# EAGLE design QuadF32 (EAGLE 9.6.0)
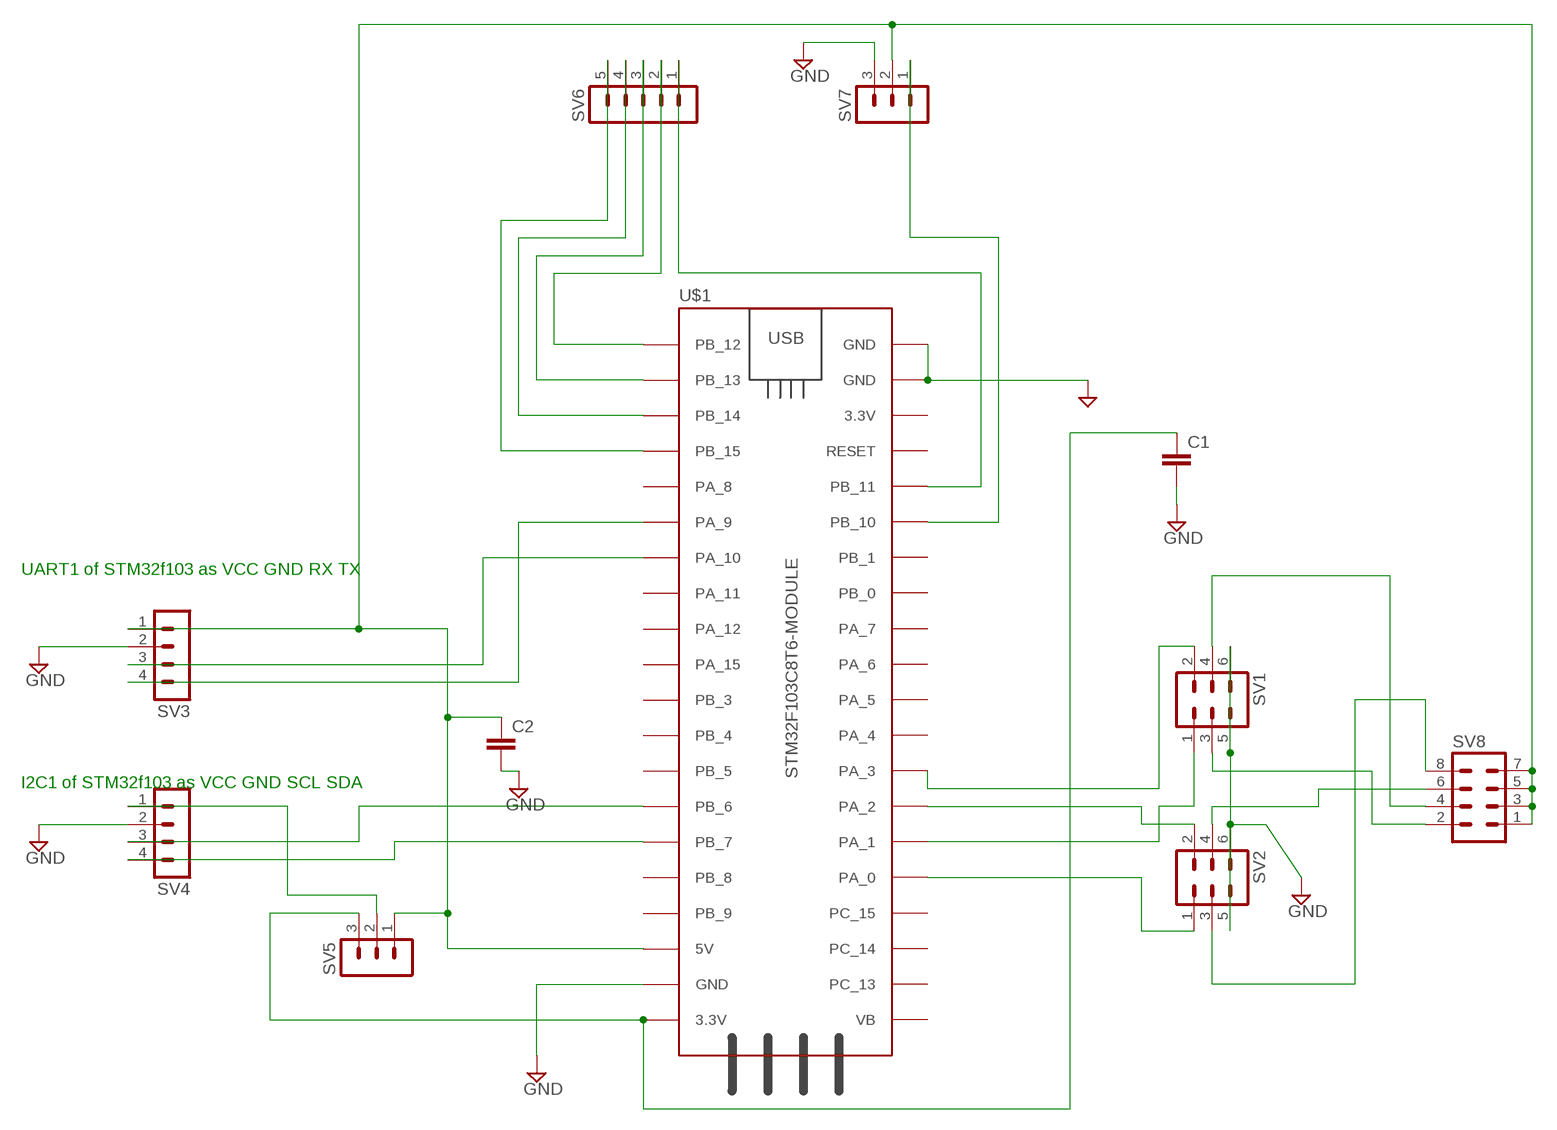
[diagram p0: schematic, sheet 1]

## Parts
C1  C5/2.5  [C5B2.5]
C2  C5/2.5  [C5B2.5]
SV1  MA03-2  [MA03-2]
SV2  MA03-2  [MA03-2]
SV3  MA04-1  [MA04-1]
SV4  MA04-1  [MA04-1]
SV5  MA03-1  [MA03-1]
SV6  MA05-1  [MA05-1]
SV7  MA03-1  [MA03-1]
SV8  MA04-2  [MA04-2]
U$1  STM32F103C8T6-MODULE  [STM32F103C8T6-MODULE]

## Nets
GND: C1.2 C2.2 SV1.5 SV1.6 SV2.5 SV2.6 SV3.2 SV4.2 SV7.3 U$1.GND_1(GND) U$1.GND_2(GND) U$1.GND_3(GND)
N$1: SV4.3 U$1.PB_6
N$2: SV4.4 U$1.PB_7
N$3: SV3.3 U$1.PA_10
N$4: SV3.4 U$1.PA_9
N$5: SV2.1 U$1.PA_0
N$6: SV2.2 U$1.PA_2
N$7: SV1.1 U$1.PA_1
N$8: SV1.2 U$1.PA_3
N$9: SV6.5 U$1.PB_15
N$10: SV6.4 U$1.PB_14
N$11: SV6.3 U$1.PB_13
N$12: SV6.2 U$1.PB_12
N$13: SV6.1 U$1.PB_11
N$14: SV7.1 U$1.PB_10
N$15: SV1.4 SV8.4
N$19: C1.1 SV5.3 U$1.3.3V_1(3.3V)
N$20: SV4.1 SV5.2
N$23: C2.1 SV3.1 SV5.1 SV7.2 SV8.1 SV8.3 SV8.5 SV8.7 U$1.5V
N$24: SV2.3 SV8.8
N$25: SV2.4 SV8.6
N$26: SV1.3 SV8.2
Unconnected: U$1.3.3V_2(3.3V) U$1.PA_4 U$1.PA_5 U$1.PA_6 U$1.PA_7 U$1.PA_8 U$1.PA_11 U$1.PA_12 U$1.PA_15 U$1.PB_0 U$1.PB_1 U$1.PB_3 U$1.PB_4 U$1.PB_5 U$1.PB_8 U$1.PB_9 U$1.PC_13 U$1.PC_14 U$1.PC_15 U$1.RESET U$1.VB

## Notes on the sheet
- UART1 of STM32f103 as VCC GND RX TX
- I2C1 of STM32f103 as VCC GND SCL SDA

## Library data of the parts
C1 C2 = capacitor-wima:C: CAPACITOR naming: grid - package width
SV1 SV2 = con-lstb:MA03-2: PIN HEADER; OC_FARNELL: unknown; OC_NEWARK: unknown
SV3 SV4 = con-lstb:MA04-1: PIN HEADER; OC_FARNELL: unknown; OC_NEWARK: unknown
SV5 SV7 = con-lstb:MA03-1: PIN HEADER; OC_FARNELL: unknown; OC_NEWARK: unknown
SV6 = con-lstb:MA05-1: PIN HEADER; OC_FARNELL: unknown; OC_NEWARK: unknown
SV8 = con-lstb:MA04-2: PIN HEADER; OC_FARNELL: unknown; OC_NEWARK: unknown
U$1 = stm32f103c8t6_module:STM32F103C8T6-MODULE: STM32F103C8T6 module with ARM Cortex-3, 20kB SRAM, 64kB Flash, 72MHz

## Board
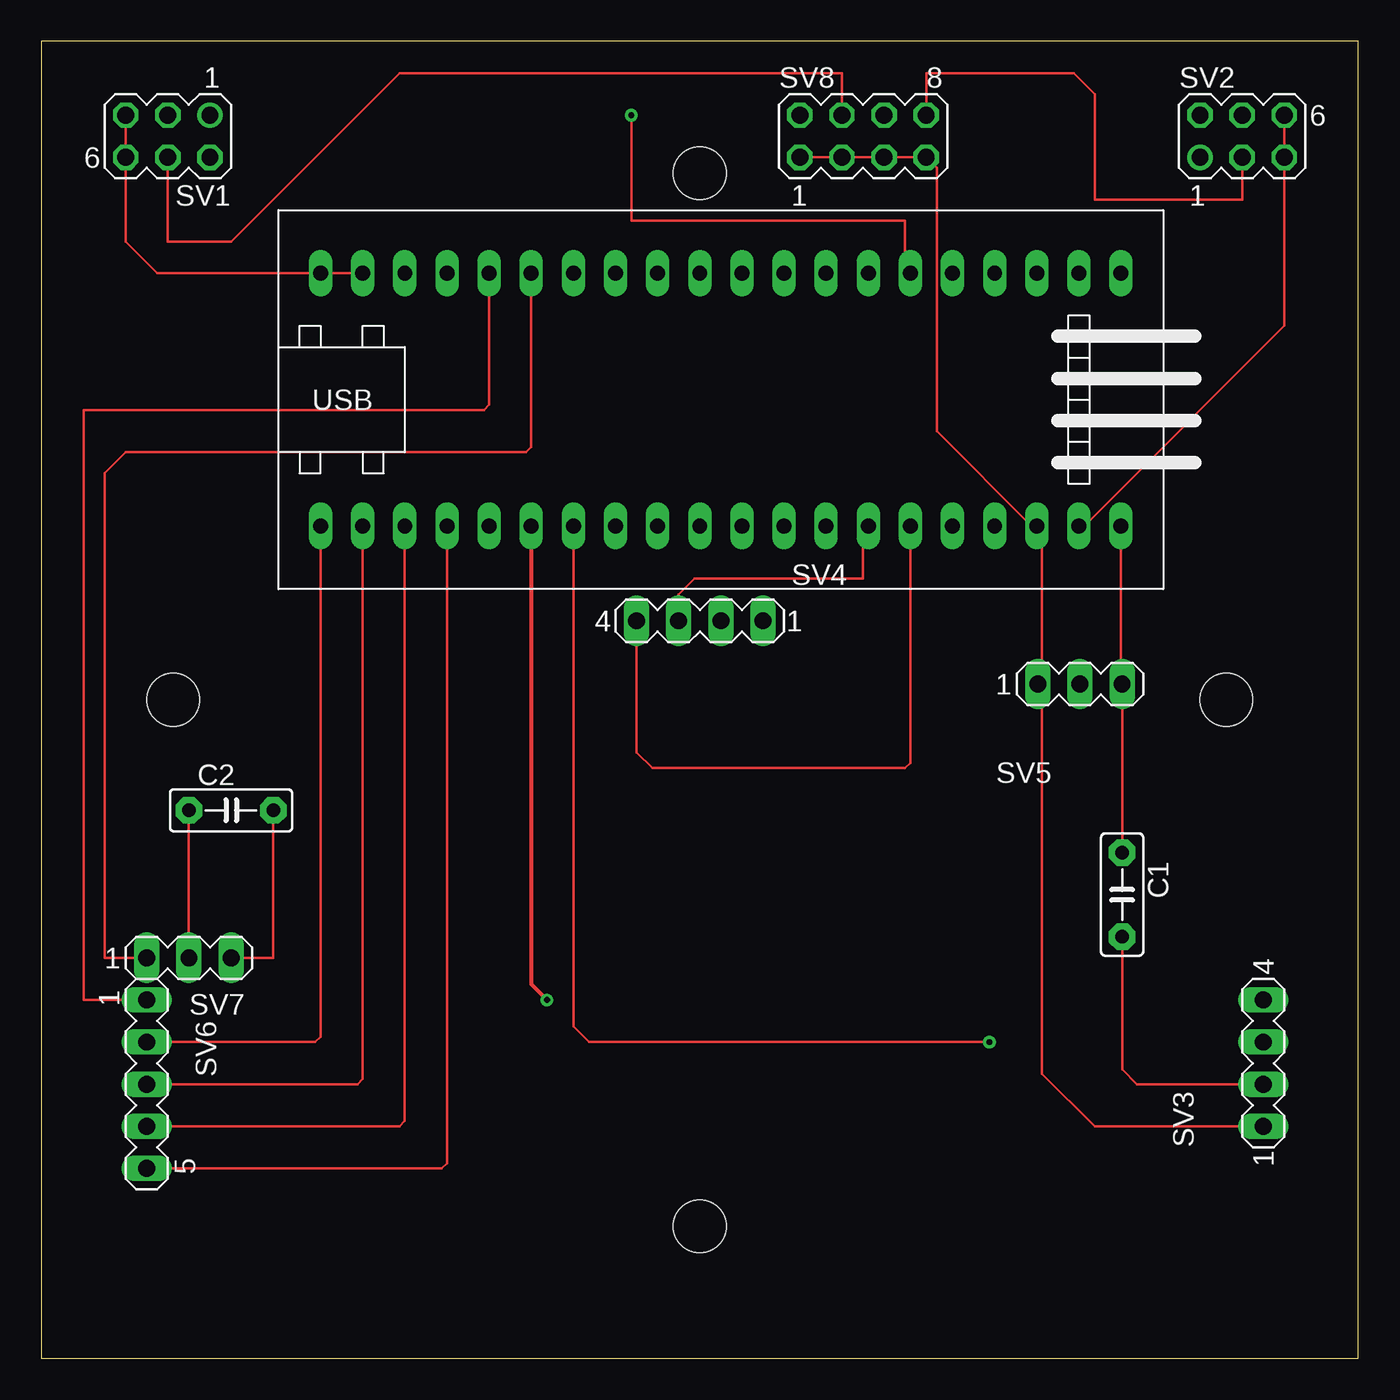
[diagram p1: board, top side]
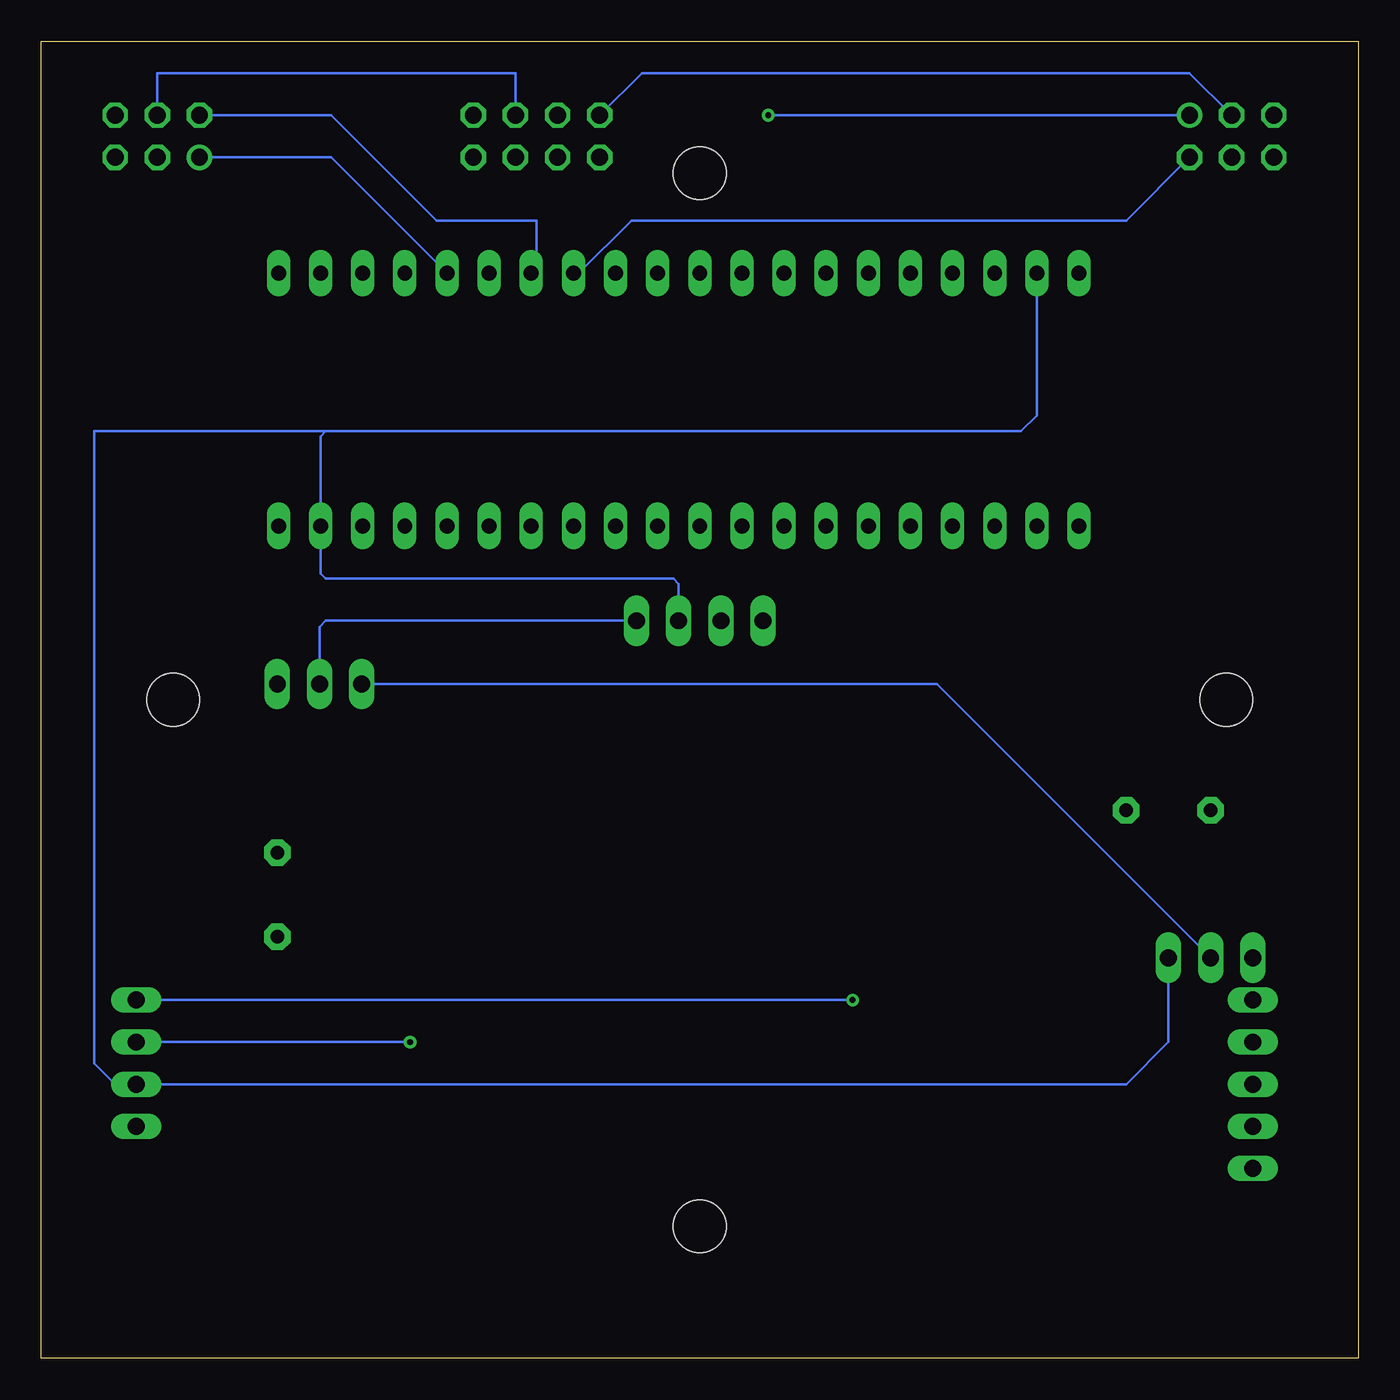
[diagram p2: board, bottom side, seen from below]

Size 79.38 x 79.38 mm. Coordinates in mm from the lower left corner, seen from the top.
Outline: 0,0 79.38,0 79.38,79.38 0,79.38 0,0
Copper layers (1*16): Top 0.035mm / dielectric 1.5mm / Bottom 0.035mm
Design rules "default": minimum track width 6mil, minimum drill 0.35mm, track to track 6mil, track to pad 6mil, pad to pad 6mil, via to via 6mil, smd to smd 6mil, copper to edge 40mil, drill to drill 6mil, minimum pad ring 10mil, minimum via ring 8mil, stop-mask expansion 4mil, vias tented up to drill 0mil, thermal gap 10mil
Holes 3.17 mm at 39.69,71.44 7.94,39.69 39.69,7.94 71.44,39.69

### Footprints (pad centres in the part's own frame; a part is rotated, then mirrored left to right if it is on the bottom)
C5B2.5 = drill 0.813 pad 1.6 octagon: 1 -2.54,0; 2 2.54,0
MA03-2 = drill 1.016: 1 -2.54,-1.27 | drill 1.016 octagon: 2 -2.54,1.27; 3 0,-1.27; 4 0,1.27; 5 2.54,-1.27; 6 2.54,1.27
MA04-1 = drill 1.016 long: 1 -3.81,0; 2 -1.27,0; 3 1.27,0; 4 3.81,0
MA03-1 = drill 1.016 long: 1 -2.54,0; 2 0,0; 3 2.54,0
MA05-1 = drill 1.016 long: 1 -5.08,0; 2 -2.54,0; 3 0,0; 4 2.54,0; 5 5.08,0
MA04-2 = drill 1.016 octagon: 1 -3.81,-1.27; 2 -3.81,1.27; 3 -1.27,-1.27; 4 -1.27,1.27; 5 1.27,-1.27; 6 1.27,1.27; 7 3.81,-1.27; 8 3.81,1.27
STM32F103C8T6-MODULE = drill 0.9 long: 3.3V_1 25.4,-7.62; 3.3V_2 -17.78,7.62; 5V 20.32,-7.62; GND_1 22.86,-7.62; GND_2 -20.32,7.62; GND_3 -22.86,7.62; PA_0 15.24,7.62; PA_1 12.7,7.62; PA_2 10.16,7.62; PA_3 7.62,7.62; PA_4 5.08,7.62; PA_5 2.54,7.62; PA_6 0,7.62; PA_7 -2.54,7.62; PA_8 -12.7,-7.62; PA_9 -10.16,-7.62; PA_10 -7.62,-7.62; PA_11 -5.08,-7.62; PA_12 -2.54,-7.62; PA_15 0,-7.62; PB_0 -5.08,7.62; PB_1 -7.62,7.62; PB_3 2.54,-7.62; PB_4 5.08,-7.62; PB_5 7.62,-7.62; PB_6 10.16,-7.62; PB_7 12.7,-7.62; PB_8 15.24,-7.62; PB_9 17.78,-7.62; PB_10 -10.16,7.62; PB_11 -12.7,7.62; PB_12 -22.86,-7.62; PB_13 -20.32,-7.62; PB_14 -17.78,-7.62; PB_15 -15.24,-7.62; PC_13 22.86,7.62; PC_14 20.32,7.62; PC_15 17.78,7.62; RESET -15.24,7.62; VB 25.4,7.62

### Placement (x,y rotation side)
C1  65.15,27.94 270 top
C2  11.43,33.02 0 top
SV1  7.62,73.66 180 top
SV2  72.39,73.66 0 top
SV3  73.66,17.78 90 top
SV4  39.69,44.45 180 top
SV5  62.61,40.64 0 top
SV6  6.35,16.51 270 top
SV7  8.89,24.13 0 top
SV8  49.53,73.66 0 top
U$1  39.69,57.78 0 top

### Tracks (layer width: path | path; a pad name or v marks a point on that pad's centre or on a via)
GND
  Top 0.152: SV1.5 SV1.6 5.08,67.31 6.99,65.41 U$1.GND_3 | SV2.6 SV2.5 74.93,62.23 62.87,50.16 U$1.GND_1 | U$1.GND_2 U$1.GND_3 | 16.51,65.41 U$1.GND_3 | SV3.2 66.04,16.51 65.15,17.4 C1.2 | C2.2 13.97,24.13 SV7.3
  Bottom 0.152: U$1.GND_2 19.37,56.83 20.32,55.88 62.23,55.88 | 62.23,55.88 76.2,55.88 76.2,17.78 74.93,16.51 SV3.2 13.97,16.51 11.43,19.05 SV7.3 | 62.23,55.88 62.55,55.56 U$1.GND_1 62.55,47.31 62.23,46.99 41.27,46.99 40.96,46.67 SV4.2
N$1
  Top 0.152: U$1.PB_6 49.53,49.85 49.53,46.99 39.37,46.99 38.42,46.04 SV4.3
N$2
  Top 0.152: U$1.PB_7 52.39,35.88 52.07,35.56 36.83,35.56 35.88,36.51 SV4.4
N$3  (via drill 0.35)
  Top 0.152: U$1.PA_10 32.07,20 33.02,19.05 v57.15,19.05
  Bottom 0.152: v57.15,19.05 SV3.3
N$4  (via drill 0.35)
  Top 0.254: v30.48,21.59 29.53,22.54 U$1.PA_9
  Bottom 0.152: SV3.4 v30.48,21.59
N$5
  Bottom 0.152: U$1.PA_0 61.91,72.39 SV2.1
N$6
  Bottom 0.152: U$1.PA_2 49.53,65.72 49.53,68.58 55.56,68.58 61.91,74.93 SV2.2
N$7  (via drill 0.35)
  Top 0.152: U$1.PA_1 52.07,65.72 52.07,68.58 35.56,68.58 v35.56,74.93
  Bottom 0.152: SV1.1 v35.56,74.93
N$8
  Bottom 0.152: SV1.2 13.97,68.58 43.81,68.58 46.99,65.41 U$1.PA_3
N$9
  Top 0.152: U$1.PB_15 24.45,11.75 24.13,11.43 SV6.5
N$10
  Top 0.152: U$1.PB_14 21.91,14.29 21.59,13.97 SV6.4
N$11
  Top 0.152: U$1.PB_13 19.37,16.83 19.05,16.51 SV6.3
N$12
  Top 0.152: U$1.PB_12 16.83,19.37 16.51,19.05 SV6.2
N$13
  Top 0.152: SV6.1 2.54,21.59 2.54,57.15 26.67,57.15 26.99,57.47 U$1.PB_11
N$14
  Top 0.152: SV7.1 3.81,24.13 3.81,53.34 5.08,54.61 29.21,54.61 29.53,54.93 U$1.PB_10
N$15
  Top 0.152: SV1.4 7.62,67.31 11.43,67.31 21.59,77.47 48.26,77.47 SV8.4
N$19
  Top 0.152: C1.1 SV5.3 65.09,40.7 U$1.3.3V_1
N$20
  Bottom 0.152: 43.81,44.45 SV4.1 62.23,44.45 62.61,44.07 SV5.2
N$23
  Top 0.152: SV8.1 SV8.3 SV8.5 SV8.7 53.98,71.75 53.98,55.88 59.69,50.16 U$1.5V 60.33,50.16 60.33,40.64 | 60.33,40.64 60.33,17.14 63.5,13.97 SV3.1 | 60.33,40.64 SV5.1 | C2.1 SV7.2
  Bottom 0.152: SV7.2 25.4,40.64 SV5.1
N$24
  Top 0.152: SV2.3 72.39,69.85 63.5,69.85 63.5,76.2 62.23,77.47 53.34,77.47 SV8.8
N$25
  Bottom 0.152: SV2.4 72.39,77.47 50.8,77.47 SV8.6
N$26
  Bottom 0.152: SV1.3 10.16,77.47 43.18,77.47 SV8.2